# EasyEDA schematic SCH_SpaceDrums_easyeda.json
TITLE: Sheet_1; REV: 1.0; Date: 2025-12-27; Sheet: 1/1; Drawn By: Arpan Mondal; Company: Makestreme
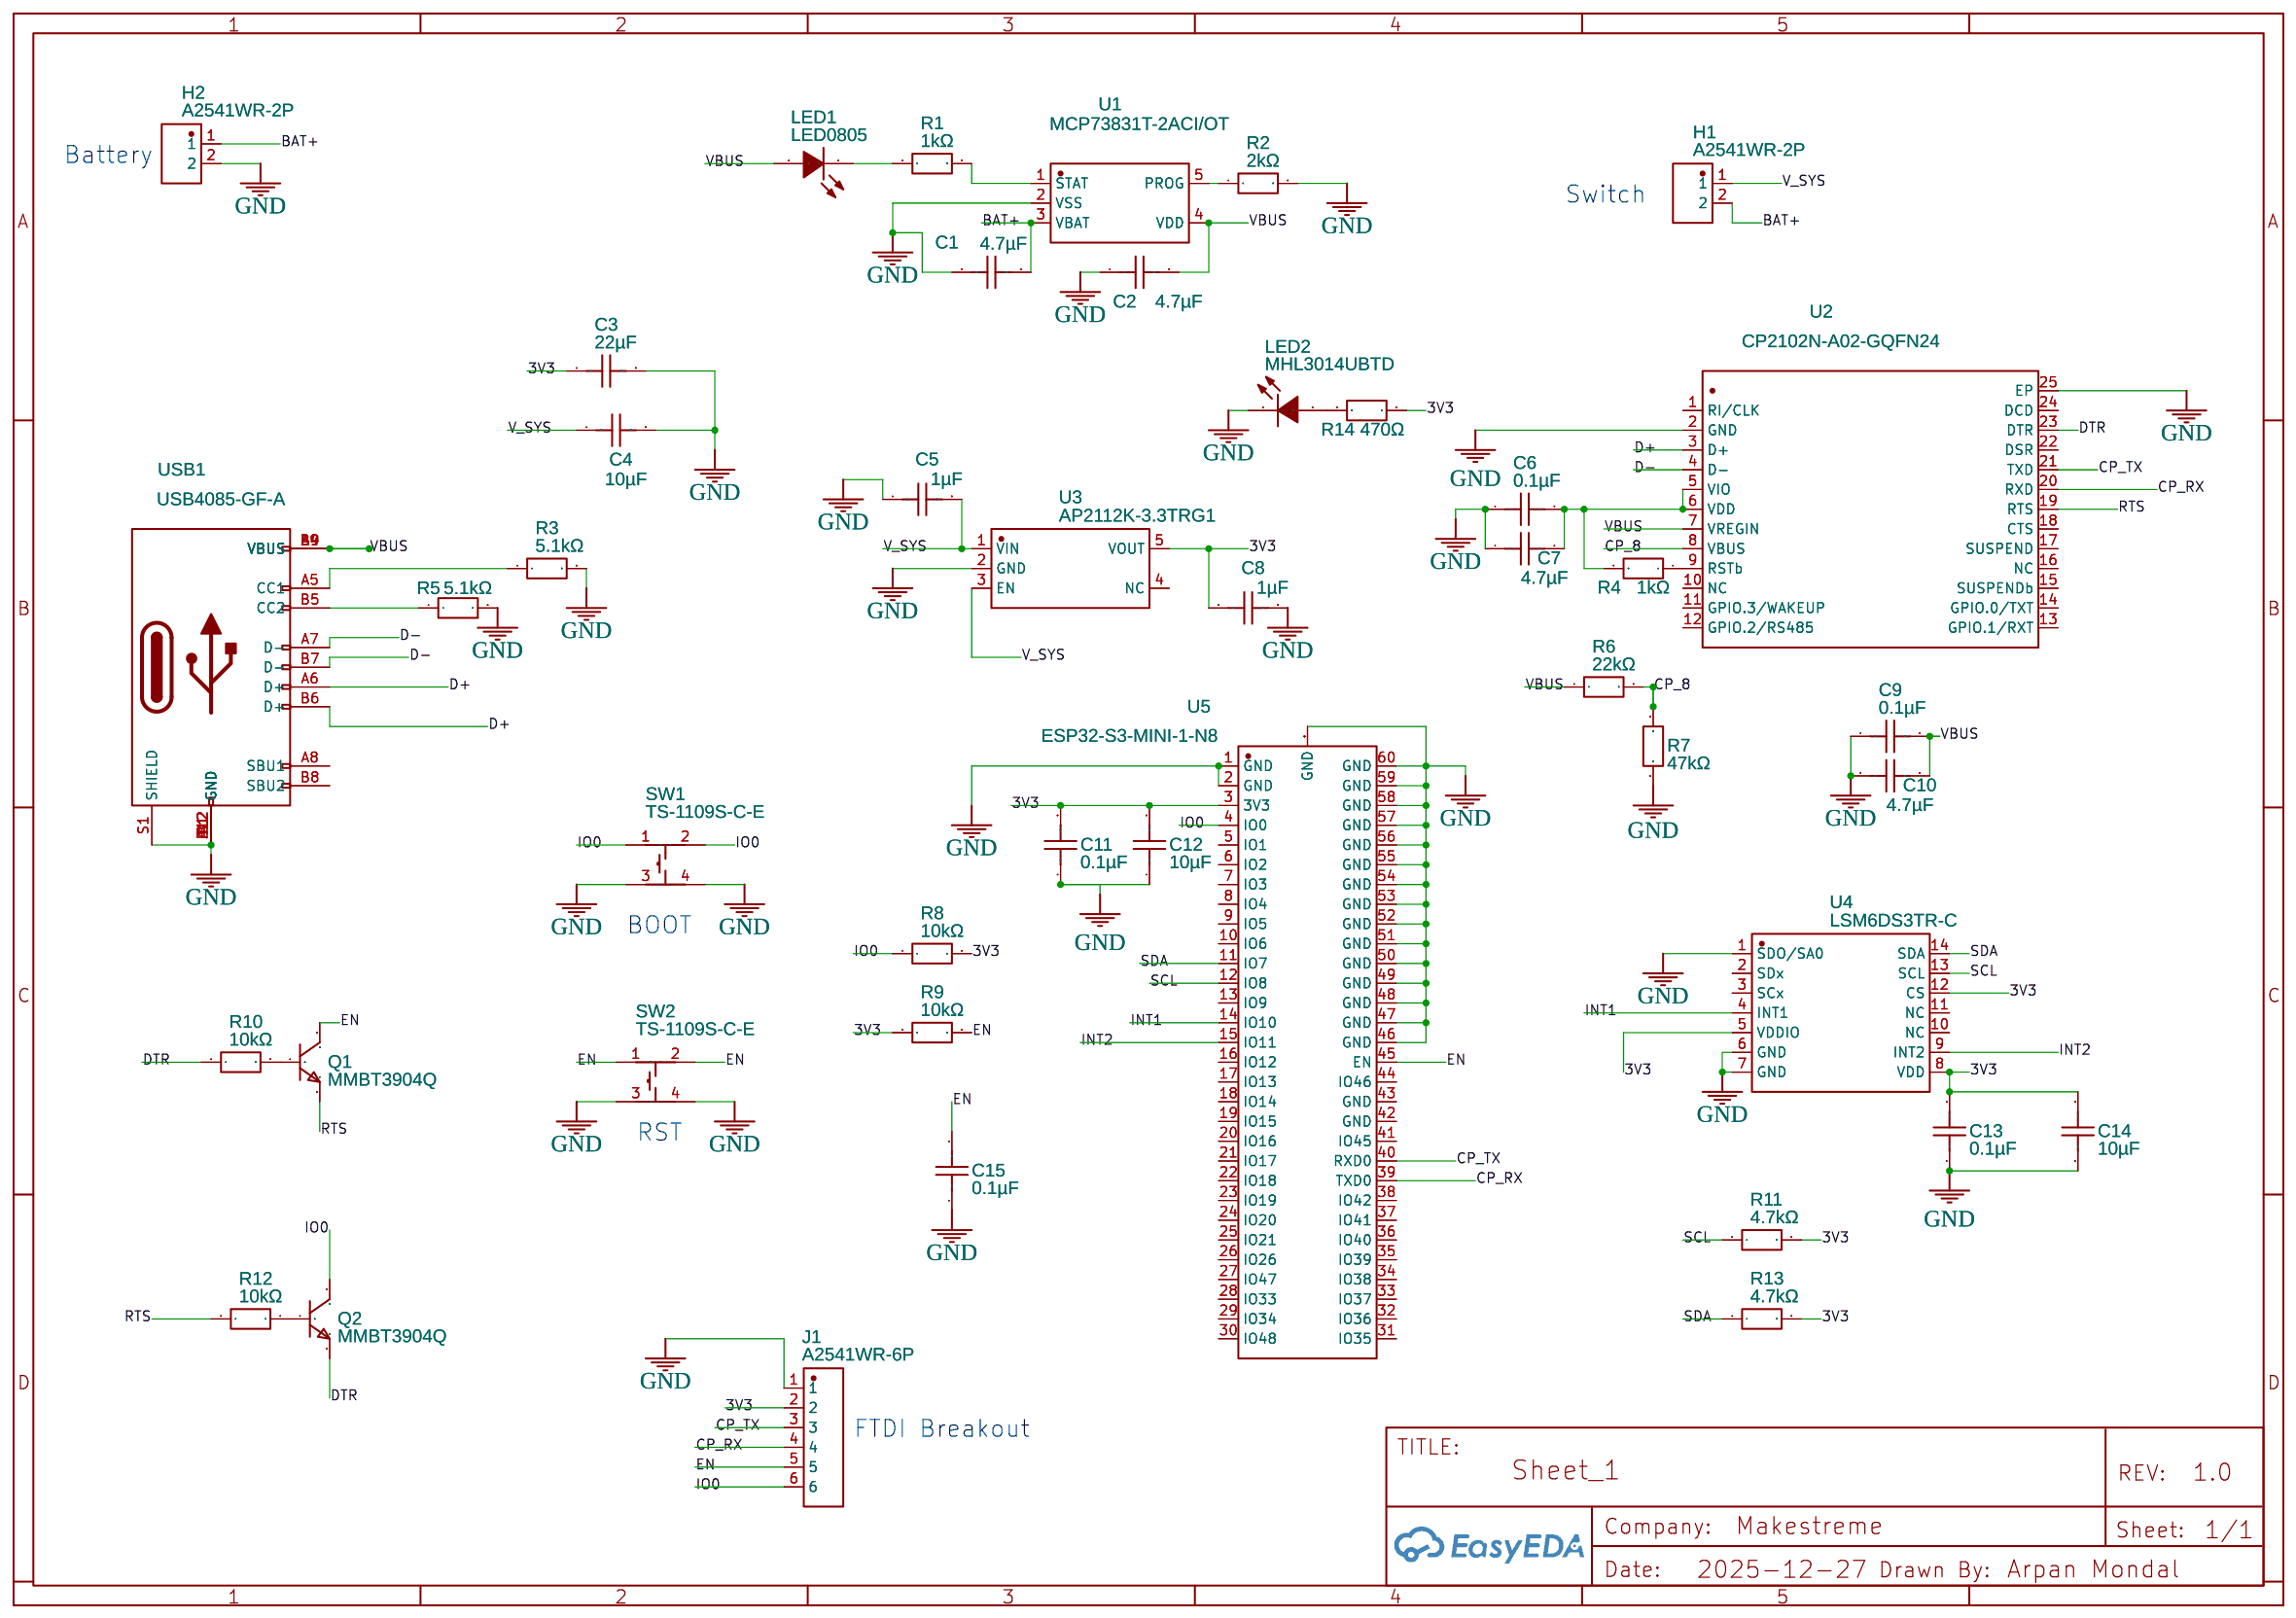
[diagram p0: schematic sheet]

## Parts
C1  4.7µF  [C0805]
C2  4.7µF  [C0805]
C3  22µF  [C0805]
C4  10µF  [C0805]
C5  1µF  [C0805]
C6  0.1µF  [C0805]
C7  4.7µF  [C0805]
C8  1µF  [C0805]
C9  0.1µF  [C0805]
C10  4.7µF  [C0805]
C11  0.1µF  [C0805]
C12  10µF  [C0805]
C13  0.1µF  [C0805]
C14  10µF  [C0805]
C15  0.1µF  [C0805]
H1  A2541WR-2P  [HDR-TH_2P-P2.54-H-M-W10.0]
H2  A2541WR-2P  [HDR-TH_2P-P2.54-H-M-W10.0]
J1  A2541WR-6P  [HDR-TH_6P-P2.54-H-M-W10.3]
LED1  LED0805  [LED0805-RD]
LED2  MHL3014UBTD  [LED-TH_BD3.9-P2.54-RD]
Q1  MMBT3904Q  [SOT-23-3_L2.9-W1.3-P1.90-LS2.4-BR]
Q2  MMBT3904Q  [SOT-23-3_L2.9-W1.3-P1.90-LS2.4-BR]
R1  1kΩ  [R0805]
R2  2kΩ  [R0805]
R3  5.1kΩ  [R0805]
R4  1kΩ  [R0805]
R5  5.1kΩ  [R0805]
R6  22kΩ  [R0805]
R7  47kΩ  [R0805]
R8  10kΩ  [R0805]
R9  10kΩ  [R0805]
R10  10kΩ  [R0805]
R11  4.7kΩ  [R0805]
R12  10kΩ  [R0805]
R13  4.7kΩ  [R0805]
R14  470Ω  [R0805]
SW1  TS-1109S-C-E  [SW-SMD_4P-L4.5-W4.5-P3.00-LS7.0]
SW2  TS-1109S-C-E  [SW-SMD_4P-L4.5-W4.5-P3.00-LS7.0]
U1  MCP73831T-2ACI/OT  [SOT-23-5_L3.0-W1.7-P0.95-LS2.8-BL]
U2  CP2102N-A02-GQFN24  [QFN-24_L4.0-W4.0-P0.50-TL-EP2.5]
U3  AP2112K-3.3TRG1  [SOT-25-5_L2.9-W1.6-P0.95-LS2.8-BL]
U4  LSM6DS3TR-C  [LGA-14_L3.0-W2.5-P0.50-TL]
U5  ESP32-S3-MINI-1-N8  [BULETM-SMD_ESP32-S3-MINI-1-N8]
USB1  USB4085-GF-A  [USC-C-SMD_USB4085-GF-A]

## Library data of the parts
C1-C15 = CC0805FRNPO0BN680: Supplier: LCSC; Supplier Part: C576904; Manufacturer: YAGEO(国巨); JLCPCB Part Class: Extended Part; Contributor: lcsc
H1 H2 = A2541WR-2P: Contributor: eng.mostafa2571; Supplier: LCSC; Supplier Part: C225488; Manufacturer: CJT(长江连接器); JLCPCB Part Class: Extended Part
J1 = A2541WR-6P: Contributor: ARNABMACH0; Supplier: LCSC; Supplier Part: C225492; Manufacturer: CJT(长江连接器); JLCPCB Part Class: Extended Part
LED1 = LED0805: Contributor: LCSC; Supplier: LCSC; Supplier Part: C9900012722; Manufacturer: null; Manufacturer Part: led0805; JLCPCB Part Class: Extended Part
LED2 = MHL3014UBTD: Contributor: LCSC; Supplier: LCSC; Supplier Part: C473815; Manufacturer: MEIHUA(美华); JLCPCB Part Class: Extended Part
Q1 Q2 = MMBT3904Q: Contributor: lcsc; Supplier: LCSC; Supplier Part: C2942583; Manufacturer: YANGJIE(扬杰); JLCPCB Part Class: Extended Part
R1-R14 = FRC0805F7873TS: Supplier: LCSC; Supplier Part: C2933500; Manufacturer: FOJAN(富捷); JLCPCB Part Class: Extended Part; Contributor: lcsc
SW1 SW2 = TS-1109S-C-E: Contributor: LCSC; Supplier: LCSC; Supplier Part: C561507; Manufacturer: XKB Connectivity(中国星坤); JLCPCB Part Class: Extended Part
U1 = MCP73831T-2ACI/OT: Contributor: LCSC; Supplier: LCSC; Supplier Part: C424093; Manufacturer: MICROCHIP(美国微芯); JLCPCB Part Class: Extended Part
U2 = CP2102N-A02-GQFN24: Contributor: LCSC; Supplier: LCSC; Supplier Part: C1550551; Manufacturer: SKYWORKS/SILICON LABS(芯科); JLCPCB Part Class: Extended Part
U3 = AP2112K-3.3TRG1: Contributor: LCSC; Supplier: LCSC; Manufacturer: DIODES(美台); Supplier Part: C51118; JLCPCB Part Class: Extended Part
U4 = LSM6DS3TR-C: Contributor: LCSC; Supplier: LCSC; Supplier Part: C967633; Manufacturer: ST(意法半导体); JLCPCB Part Class: Extended Part
U5 = ESP32-S3-MINI-1-N8: Contributor: lcsc; Supplier: LCSC; Supplier Part: C2913206; Manufacturer: ESPRESSIF(乐鑫); JLCPCB Part Class: Extended Part
USB1 = USB4085-GF-A: Contributor: lcsc; Supplier: LCSC; Supplier Part: C9900013983; Manufacturer: null; JLCPCB Part Class: Extended Part

## Nets
3V3: C3.1 C8.1 C11.2 C12.2 C13.2 C14.2 J1.2 R8.2 R9.1 R11.2 R13.2 R14.1 U3.5(VOUT) U4.5(VDDIO) U4.8(VDD) U4.12(CS) U5.3(3V3)
GND: C1.1 C2.1 C3.2 C4.2 C5.1 C6.1 C7.1 C8.2 C9.1 C10.1 C11.1 C12.1 C13.1 C14.1 C15.1 H2.2 J1.1 LED2.1(-) R2.2 R3.2 R5.2 R7.1 SW1.3 SW1.4 SW2.3 SW2.4 U1.2(VSS) U2.2(GND) U2.25(EP) U3.2(GND) U4.1(SDO/SA0) U4.6(GND) U4.7(GND) U5.1(GND) U5.2(GND) U5.46(GND) U5.47(GND) U5.48(GND) U5.49(GND) U5.50(GND) U5.51(GND) U5.52(GND) U5.53(GND) U5.54(GND) U5.55(GND) U5.56(GND) U5.57(GND) U5.58(GND) U5.59(GND) U5.60(GND) U5.GND USB1.A1(GND) USB1.A12(GND) USB1.B1(GND) USB1.B12(GND) USB1.S1(SHIELD)
VBUS: C2.2 C9.2 C10.2 LED1.2(+) R6.1 U1.4(VDD) U2.7(VREGIN) USB1.A4(VBUS) USB1.A9(VBUS) USB1.B4(VBUS) USB1.B9(VBUS)
BAT+: C1.2 H1.2 H2.1 U1.3(VBAT)
CP_8: R6.2 R7.2 U2.8(VBUS)
CP_RX: J1.4 U2.20(RXD) U5.39(TXD0)
CP_TX: J1.3 U2.21(TXD) U5.40(RXD0)
D+: U2.3(D+) USB1.A6(D+) USB1.B6(D+)
D-: U2.4(D-) USB1.A7(D-) USB1.B7(D-)
DTR: Q2.2(E) R10.1 U2.23(DTR)
EN: C15.2 J1.5 Q1.3(C) R9.2 SW2.1 SW2.2 U5.45(EN)
INT1: U4.4(INT1) U5.14(IO10)
INT2: U4.9(INT2) U5.15(IO11)
IO0: J1.6 Q2.3(C) R8.1 SW1.1 SW1.2 U5.4(IO0)
RTS: Q1.2(E) R12.2 U2.19(RTS)
SCL: R11.1 U4.13(SCL) U5.12(IO8)
SDA: R13.1 U4.14(SDA) U5.11(IO7)
V_SYS: C4.1 C5.2 H1.1 U3.1(VIN) U3.3(EN)
Net-(C6-2): C6.2 C7.2 R4.2 U2.5(VIO) U2.6(VDD)
Net-(LED1-1): LED1.1(-) R1.1
Net-(LED2-2): LED2.2(+) R14.2
Net-(Q1-1): Q1.1(B) R10.2
Net-(Q2-1): Q2.1(B) R12.1
Net-(R1-2): R1.2 U1.1(STAT)
Net-(R2-1): R2.1 U1.5(PROG)
Net-(R3-1): R3.1 USB1.A5(CC1)
Net-(R4-1): R4.1 U2.9(RSTb)
Net-(R5-1): R5.1 USB1.B5(CC2)

Not connected (* = marked no-connect by the designer): U2 1(RI/CLK) 10(NC) 11(GPIO.3/WAKEUP) 12(GPIO.2/RS485) 13(GPIO.1/RXT) 14(GPIO.0/TXT) 15(SUSPENDb) 16(NC) 17(SUSPEND) 18(CTS) 22(DSR) 24(DCD); U3 4(NC); U4 2(SDx) 3(SCx) 10(NC) 11(NC); U5 5(IO1) 6(IO2) 7(IO3) 8(IO4) 9(IO5) 10(IO6) 13(IO9) 16(IO12) 17(IO13) 18(IO14) 19(IO15) 20(IO16) 21(IO17) 22(IO18) 23(IO19) 24(IO20) 25(IO21) 26(IO26) 27(IO47) 28(IO33) 29(IO34) 30(IO48) 31(IO35) 32(IO36) 33(IO37) 34(IO38) 35(IO39) 36(IO40) 37(IO41) 38(IO42) 41(IO45) 42(GND) 43(GND) 44(IO46); USB1 A8(SBU1) B8(SBU2)

## Notes on the sheet
- Battery
- Switch
- BOOT
- RST
- FTDI Breakout
